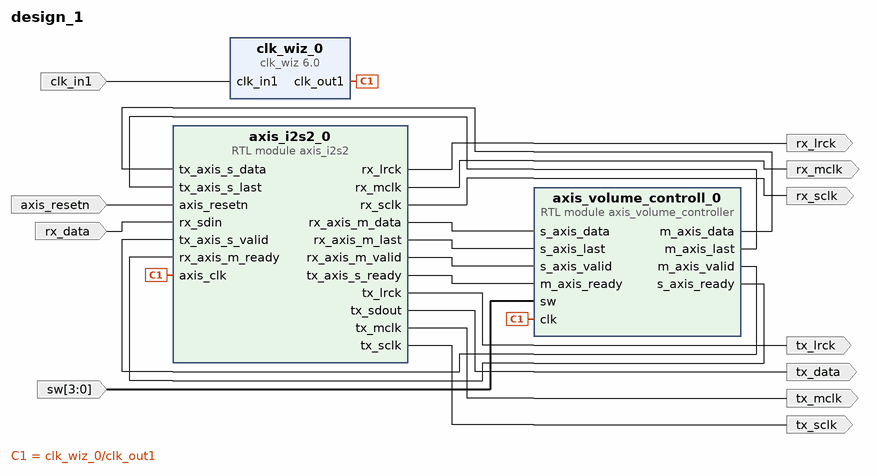
[diagram p0: block diagram of the top level]
# Vivado block design design_1, xc7z010clg400-1, Vivado 2023.2
create_bd_design design_1

create_bd_port -dir I -from 3 -to 0 sw
create_bd_port -dir O tx_data
create_bd_port -dir I -type data rx_data
create_bd_port -dir I -type rst axis_resetn
create_bd_port -dir O tx_mclk
create_bd_port -dir O tx_lrck
create_bd_port -dir O tx_sclk
create_bd_port -dir O rx_mclk
create_bd_port -dir O rx_lrck
create_bd_port -dir O rx_sclk
create_bd_port -dir I -type clk clk_in1
set_property -dict {CONFIG.CLK_DOMAIN design_1_sys_clock CONFIG.FREQ_HZ 125000000} [get_bd_ports clk_in1]

create_bd_cell -type ip -vlnv xilinx.com:ip:clk_wiz:6.0 clk_wiz_0
set_property -dict [list \
  CONFIG.CLKOUT1_JITTER 260.212 \
  CONFIG.CLKOUT1_PHASE_ERROR 279.187 \
  CONFIG.CLKOUT1_REQUESTED_OUT_FREQ 22.591 \
  CONFIG.CLK_IN1_BOARD_INTERFACE sys_clock \
  CONFIG.MMCM_CLKFBOUT_MULT_F 54.625 \
  CONFIG.MMCM_CLKOUT0_DIVIDE_F 50.375 \
  CONFIG.MMCM_DIVCLK_DIVIDE 6 \
  CONFIG.USE_BOARD_FLOW true \
  CONFIG.USE_LOCKED false \
  CONFIG.USE_RESET false \
] [get_bd_cells clk_wiz_0]
create_bd_cell -type module -reference axis_i2s2 axis_i2s2_0
create_bd_cell -type module -reference axis_volume_controller axis_volume_controll_0

# ---- connections ----

connect_bd_net [get_bd_pins axis_i2s2_0/rx_axis_m_data] [get_bd_pins axis_volume_controll_0/s_axis_data]
connect_bd_net [get_bd_pins axis_i2s2_0/rx_axis_m_last] [get_bd_pins axis_volume_controll_0/s_axis_last]
connect_bd_net [get_bd_pins axis_i2s2_0/rx_axis_m_valid] [get_bd_pins axis_volume_controll_0/s_axis_valid]
connect_bd_net [get_bd_pins axis_i2s2_0/rx_lrck] [get_bd_ports rx_lrck]
connect_bd_net [get_bd_pins axis_i2s2_0/rx_mclk] [get_bd_ports rx_mclk]
connect_bd_net [get_bd_pins axis_i2s2_0/rx_sclk] [get_bd_ports rx_sclk]
connect_bd_net [get_bd_pins axis_i2s2_0/tx_axis_s_ready] [get_bd_pins axis_volume_controll_0/m_axis_ready]
connect_bd_net [get_bd_pins axis_i2s2_0/tx_lrck] [get_bd_ports tx_lrck]
connect_bd_net [get_bd_pins axis_i2s2_0/tx_mclk] [get_bd_ports tx_mclk]
connect_bd_net [get_bd_pins axis_i2s2_0/tx_sclk] [get_bd_ports tx_sclk]
connect_bd_net [get_bd_pins axis_i2s2_0/tx_sdout] [get_bd_ports tx_data]
connect_bd_net [get_bd_ports axis_resetn] [get_bd_pins axis_i2s2_0/axis_resetn]
connect_bd_net [get_bd_pins axis_volume_controll_0/m_axis_data] [get_bd_pins axis_i2s2_0/tx_axis_s_data]
connect_bd_net [get_bd_pins axis_volume_controll_0/m_axis_last] [get_bd_pins axis_i2s2_0/tx_axis_s_last]
connect_bd_net [get_bd_pins axis_volume_controll_0/m_axis_valid] [get_bd_pins axis_i2s2_0/tx_axis_s_valid]
connect_bd_net [get_bd_pins axis_volume_controll_0/s_axis_ready] [get_bd_pins axis_i2s2_0/rx_axis_m_ready]
connect_bd_net -net clk_in1_1 [get_bd_ports clk_in1] [get_bd_pins clk_wiz_0/clk_in1]
connect_bd_net [get_bd_pins clk_wiz_0/clk_out1] [get_bd_pins axis_i2s2_0/axis_clk] [get_bd_pins axis_volume_controll_0/clk]
connect_bd_net -net rx_sdin_1 [get_bd_ports rx_data] [get_bd_pins axis_i2s2_0/rx_sdin]
connect_bd_net [get_bd_ports sw] [get_bd_pins axis_volume_controll_0/sw]

validate_bd_design
save_bd_design
